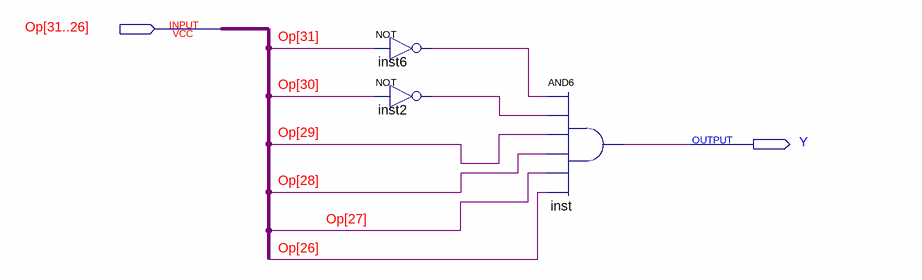
[diagram p0: schematic sheet]
// Quartus schematic LUI.bdf as structural Verilog: 3 symbols, 2 pins
module LUI (
  input  [31:26] Op,
  output Y
);

  wire inst2_out, inst6_out;

  not inst6 (inst6_out, Op[31]);
  not inst2 (inst2_out, Op[30]);
  and inst (Y, inst6_out, inst2_out, Op[29], Op[28], Op[27], Op[26]);
endmodule
